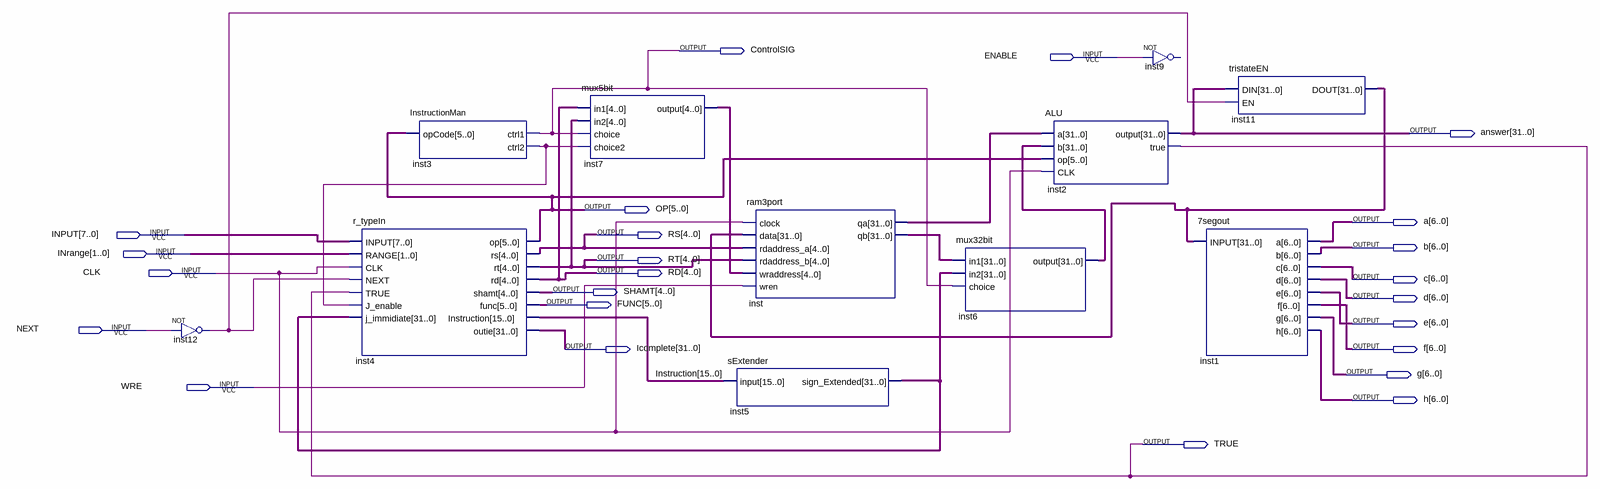
[diagram p0: schematic sheet]
// Quartus schematic Instruction_man.bdf as structural Verilog: 11 symbols, 24 pins
module Instruction_man (
  input  ENABLE,
  input  [7:0] INPUT,
  input  [1:0] INrange,
  input  CLK,
  input  NEXT,
  input  WRE,
  output ControlSIG,
  output [31:0] answer,
  output [5:0] OP,
  output [6:0] a,
  output [4:0] RS,
  output [6:0] b,
  output [4:0] RT,
  output [4:0] RD,
  output [6:0] c,
  output [4:0] SHAMT,
  output [6:0] d,
  output [5:0] FUNC,
  output [6:0] e,
  output [31:0] Icomplete,
  output [6:0] f,
  output [6:0] g,
  output [6:0] h,
  output TRUE
);

  wire inst3_ctrl2, inst12_out;
  wire [4:0] inst7_output;
  wire [15:0] Instruction;
  wire [31:0] inst5_sign_extended, inst6_output, inst11_dout, inst_qa, inst_qb;

  not inst12 (inst12_out, NEXT);
  r_typeIn inst4 (
    .INPUT(INPUT), .RANGE(INrange), .CLK(CLK), .NEXT(inst12_out), .TRUE(TRUE), .J_enable(inst3_ctrl2),
    .j_immidiate(inst5_sign_extended), .op(OP), .rs(RS), .rt(RT), .rd(RD), .shamt(SHAMT), .func(FUNC),
    .Instruction(Instruction), .outie(Icomplete));
  InstructionMan inst3 (.opCode(OP), .ctrl1(ControlSIG), .ctrl2(inst3_ctrl2));
  mux5bit inst7 (.in1(RD), .in2(RT), .choice(ControlSIG), .choice2(inst3_ctrl2), .\output (inst7_output));
  sExtender inst5 (.\input (Instruction), .sign_Extended(inst5_sign_extended));
  ram3port inst (
    .clock(CLK), .data(inst11_dout), .rdaddress_a(RS), .rdaddress_b(RT), .wraddress(inst7_output),
    .wren(WRE), .qa(inst_qa), .qb(inst_qb));
  mux32bit inst6 (.in1(inst_qb), .in2(inst5_sign_extended), .choice(ControlSIG), .\output (inst6_output));
  ALU inst2 (.a(inst_qa), .b(inst6_output), .op(OP), .CLK(CLK), .\output (answer), .true(TRUE));
  // NOT inst9 has open pins: IN=ENABLE, OUT=open
  tristateEN inst11 (.DIN(answer), .EN(inst12_out), .DOUT(inst11_dout));
  \7segout  inst1 (.INPUT(inst11_dout), .a(a), .b(b), .c(c), .d(d), .e(e), .f(f), .g(g), .h(h));
endmodule
